# EAGLE design 4081 (EAGLE 5.06)
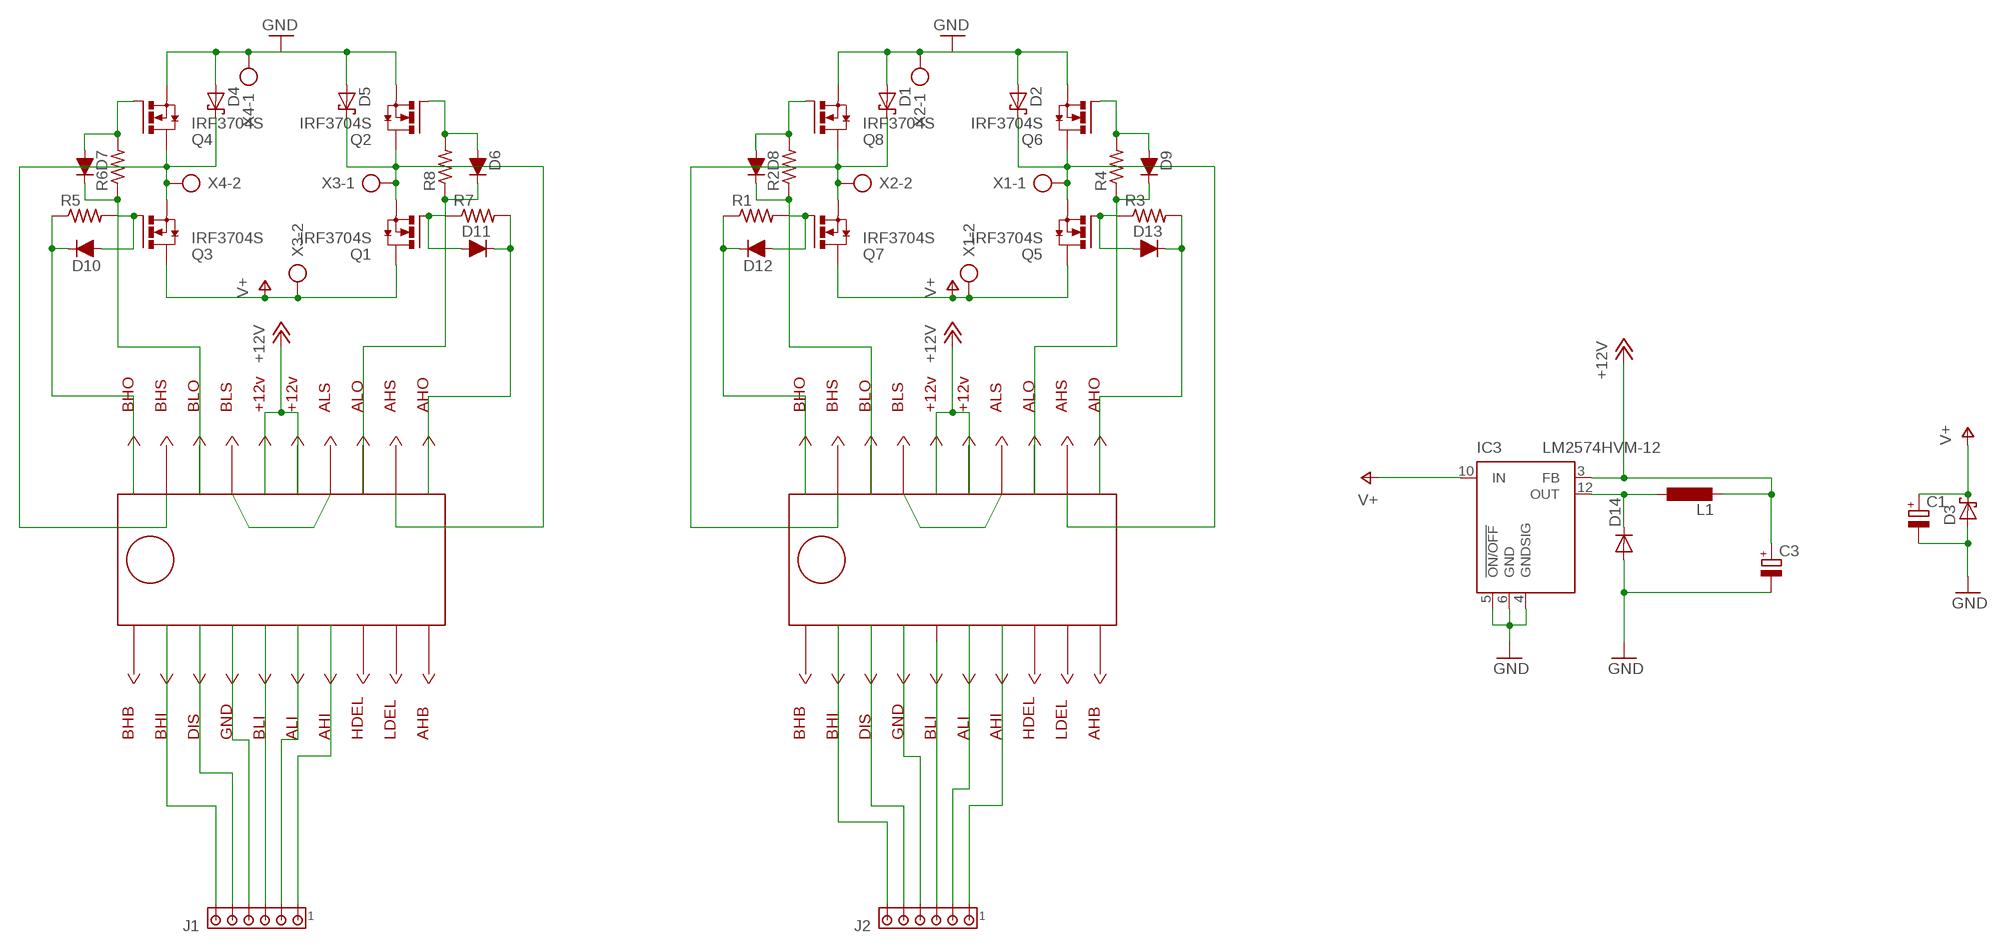
[diagram p0: schematic, sheet 1]

## Parts
C1  CPOL-EUE30-12AXIAL  [E30-12]
C3  CPOL-EU140CLH-1010  [140CLH-1010]
D1  SCHOTTKY-DIODESMC  [SMC]
D2  SCHOTTKY-DIODESMC  [SMC]
D3  SCHOTTKY-DIODESMC  [SMC]
D4  SCHOTTKY-DIODESMC  [SMC]
D5  SCHOTTKY-DIODESMC  [SMC]
D6  D-FILL-MLL-34  [MELF-MLL34]
D7  D-FILL-MLL-34  [MELF-MLL34]
D8  D-FILL-MLL-34  [MELF-MLL34]
D9  D-FILL-MLL-34  [MELF-MLL34]
D10  D-FILL-MLL-34  [MELF-MLL34]
D11  D-FILL-MLL-34  [MELF-MLL34]
D12  D-FILL-MLL-34  [MELF-MLL34]
D13  D-FILL-MLL-34  [MELF-MLL34]
D14  DIODE-DO214BA  [DO214BA]
IC1  HIP4081_SMD  [20-SOIC]
IC2  HIP4081_SMD  [20-SOIC]
IC3  LM2574HVM-12  [SO14W]
J1  MTA06-100  [10X06MTA]
J2  MTA06-100  [10X06MTA]
L1  L-EUPIS2816  [PIS2816]
Q1  IRF3704S  [D2PACK]
Q2  IRF3704S  [D2PACK]
Q3  IRF3704S  [D2PACK]
Q4  IRF3704S  [D2PACK]
Q5  IRF3704S  [D2PACK]
Q6  IRF3704S  [D2PACK]
Q7  IRF3704S  [D2PACK]
Q8  IRF3704S  [D2PACK]
R1  R-US_M1206  [M1206]
R2  R-US_M1206  [M1206]
R3  R-US_M1206  [M1206]
R4  R-US_M1206  [M1206]
R5  R-US_M1206  [M1206]
R6  R-US_M1206  [M1206]
R7  R-US_M1206  [M1206]
R8  R-US_M1206  [M1206]
X1  AK500/2  [AK500/2]
X2  AK500/2  [AK500/2]
X3  AK500/2  [AK500/2]
X4  AK500/2  [AK500/2]

## Nets
+12V: C3.+ IC1.15(VCC) IC1.16(+12V) IC2.15(VCC) IC2.16(+12V) IC3.3(FB) L1.2
AHO1: D11.1(C) IC1.11(AHO) R7.2
AHO2: D13.1(C) IC2.11(AHO) R3.2
AHS1: D5.C IC1.12(AHS) Q1.3(S) Q2.2(D) X3.1
AHS2: D2.C IC2.12(AHS) Q5.3(S) Q6.2(D) X1.1
ALO1: D6.1(C) IC1.13(ALO) R8.1
ALO2: D9.1(C) IC2.13(ALO) R4.1
ALS2: Q5.2(D) Q7.2(D) X1.2 ; supply symbol labelled V+
BHO1: D10.1(C) IC1.20(BHO) R5.1
BHO2: D12.1(C) IC2.20(BHO) R1.1
BHS1: D4.C IC1.19(BHS) Q3.3(S) Q4.2(D) X4.2
BHS2: D1.C IC2.19(BHS) Q7.3(S) Q8.2(D) X2.2
BLO1: D7.1(C) IC1.18(BLO) R6.1
BLO2: D8.1(C) IC2.18(BLO) R2.1
GND: C1.- C3.- D1.A D2.A D3.A D4.A D5.A D14.A IC1.14(ALS) IC1.17(BLS) IC2.14(ALS) IC2.17(BLS) IC3.4(GNDSIG) IC3.5(!ON/OFF) IC3.6(GND) Q2.3(S) Q4.3(S) Q6.3(S) Q8.3(S) X2.1 X4.1
N$1: D14.C IC3.12(OUT) L1.1
N$2: D8.2(A) Q8.1(G) R2.2
N$3: D9.2(A) Q6.1(G) R4.2
N$4: D13.2(A) Q5.1(G) R3.1
N$5: D12.2(A) Q7.1(G) R1.2
N$6: IC1.2(BHI) J1.1
N$7: D7.2(A) Q4.1(G) R6.2
N$8: D6.2(A) Q2.1(G) R8.2
N$9: D11.2(A) Q1.1(G) R7.1
N$10: D10.2(A) Q3.1(G) R5.2
N$11: IC1.3(DIS) J1.2
N$12: IC1.4(GND) J1.3
N$13: IC1.5(BLI) J1.4
N$14: IC1.6(ALI) J1.5
N$15: IC1.7(AHI) J1.6
N$16: IC2.2(BHI) J2.1
N$17: IC2.3(DIS) J2.2
N$18: IC2.4(GND) J2.3
N$19: J2.4
N$20: IC2.6(ALI) J2.5
N$21: IC2.7(AHI) J2.6
V+: C1.+ D3.C IC3.10(IN) Q1.2(D) Q3.2(D) X3.2
Unconnected: IC1.1(BHB) IC1.8(HDEL) IC1.9(LDEL) IC1.10(AHB) IC2.1(BHB) IC2.5(BLI) IC2.8(HDEL) IC2.9(LDEL) IC2.10(AHB)

## Library data of the parts
C1 C3 = rcl:CPOL-EU: POLARIZED CAPACITOR, European symbol
D1-D5 = diode:SCHOTTKY-DIODE: Schottky Diode
D6-D13 = semicon-smd-ipc:D-FILL-: DIODE filled
D14 = diode:DIODE-: DIODE
IC1 IC2 = A-JD3:HIP4081_SMD
IC3 = linear:LM2574?-*: SIMPLE SWITCHER 0.5A Step-Down Voltage Regulator Source: http://cache.national.com/ds/LM/LM2574.pdf
J1 J2 = con-amp:MTA06-100: AMP connector
L1 = rcl:L-EU: INDUCTOR, European symbol
Q1-Q8 = transistor-power:IRF3704: SMPS MOSFET HEXFET® Power MOSFET Source: http://www.irf.com/product-info/datasheets/data/irf3704.pdf
R1-R8 = rcl:R-US_: RESISTOR, American symbol
X1-X4 = con-ptr500:AK500/2: CONNECTOR

## Board
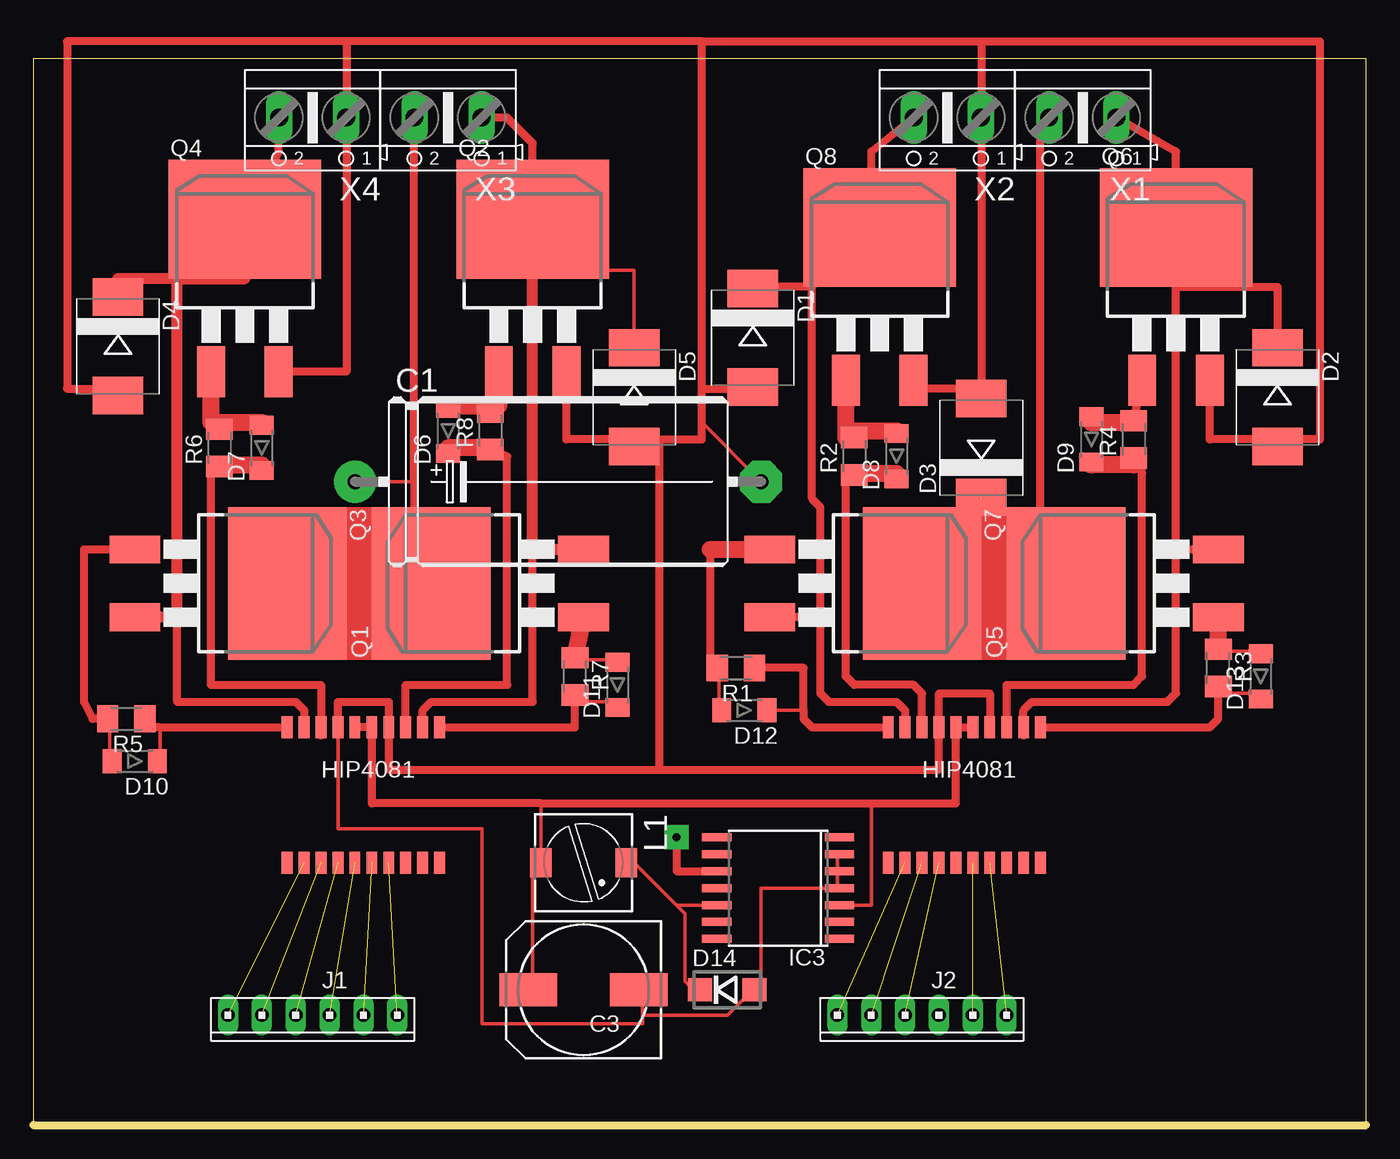
[diagram p1: board, top side]
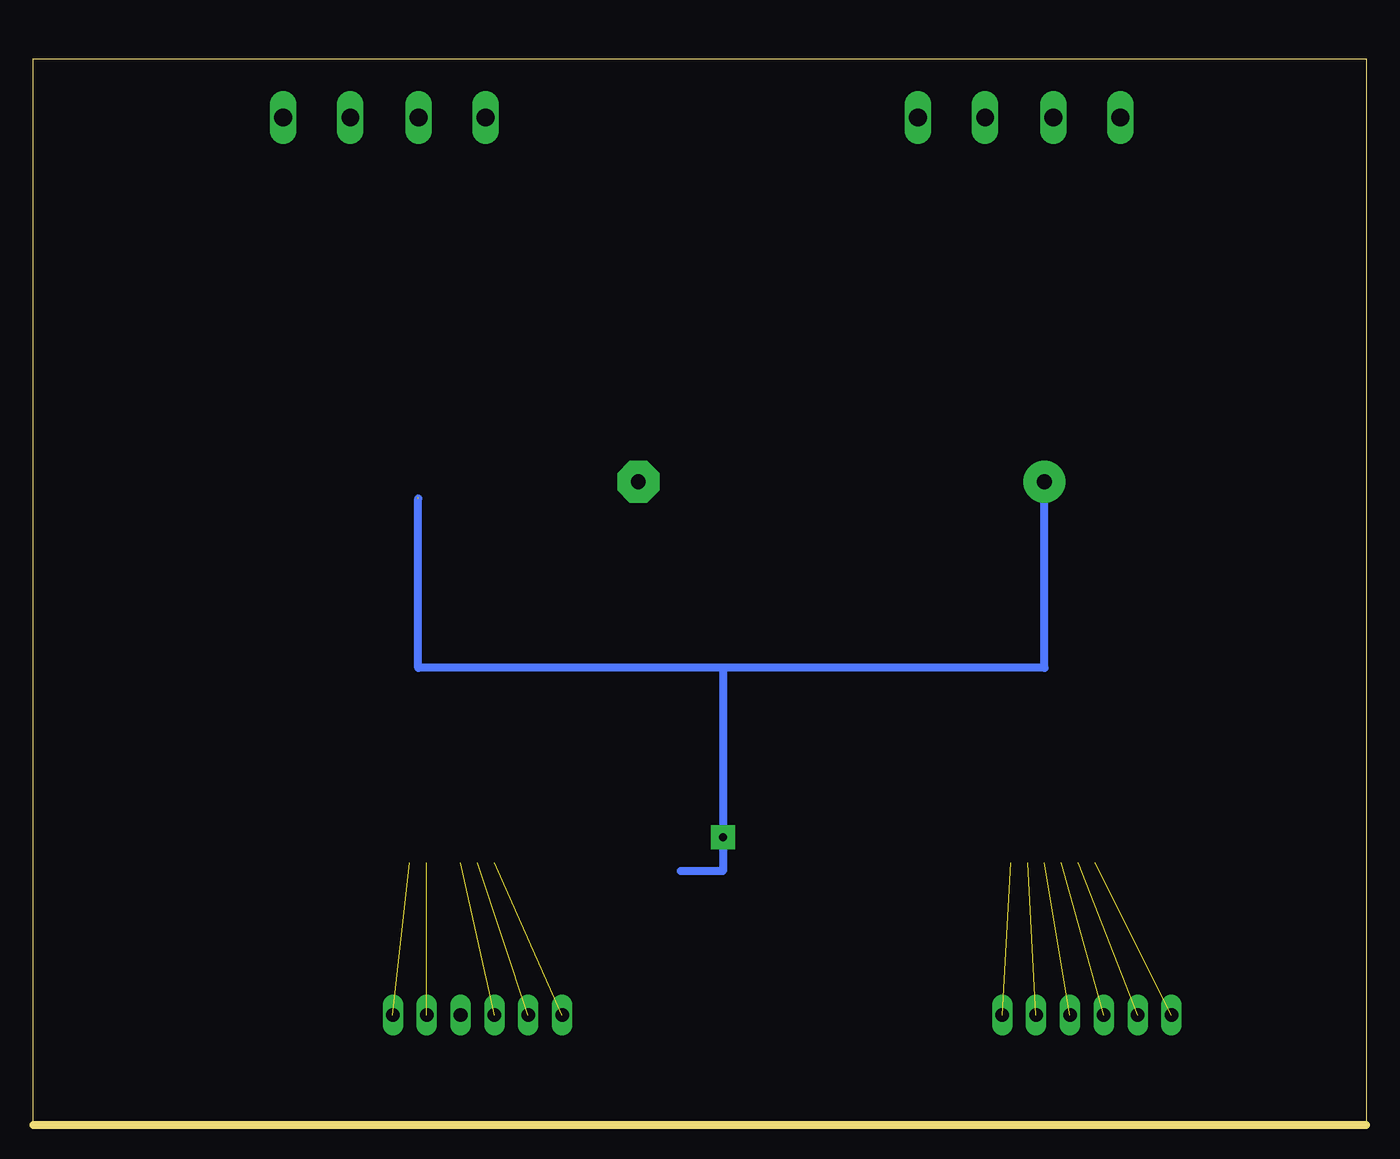
[diagram p2: board, bottom side, seen from below]

Size 100 x 80 mm. Coordinates in mm from the lower left corner, seen from the top.
Outline: 0,0 100,0 100,80 0,80 0,0
Copper layers (1*16): Top 0.035mm / dielectric 1.5mm / Bottom 0.035mm
Design rules "default *": minimum track width 10mil, minimum drill 24mil, track to track 25mil, track to pad 25mil, pad to pad 8mil, via to via 8mil, smd to smd 8mil, copper to edge 40mil, drill to drill 8mil, minimum pad ring 10mil, minimum via ring 8mil, stop-mask expansion 4mil, vias tented up to drill 0mil, thermal gap 10mil

### Footprints (pad centres in the part's own frame; a part is rotated, then mirrored left to right if it is on the bottom)
E30-12 = drill 1.118 pad 3.15 round: + -15.24,0 | drill 1.118 pad 3.15 octagon: - 15.24,0
140CLH-1010 = smd 4.3 x 2.5: + 4.15,0; - -4.15,0
SMC = smd 2.8 x 3.8: A 3.7,0; C -3.7,0
MELF-MLL34 = smd 1.4 x 1.8: 1 -1.7,0; 2 1.7,0
DO214BA = smd 1.8 x 1.7: A 2.05,0; C -2.05,0
20-SOIC = smd 0.813 x 1.676: 1 -5.08,-5.08; 2 -3.81,-5.08; 3 -2.54,-5.08; 4 -1.27,-5.08; 5 0,-5.08; 6 1.27,-5.08; 7 2.54,-5.08; 8 3.81,-5.08; 9 5.08,-5.08; 10 6.35,-5.08; 11 6.35,5.08; 12 5.08,5.08; 13 3.81,5.08; 14 2.54,5.08; 15 1.27,5.08; 16 0,5.08; 17 -1.27,5.08; 18 -2.54,5.08; 19 -3.81,5.08; 20 -5.08,5.08
SO14W = smd 0.6 x 2.2: 1 -3.81,-4.6; 2 -2.54,-4.6; 3 -1.27,-4.6; 4 0,-4.6; 5 1.27,-4.6; 6 2.54,-4.6; 7 3.81,-4.6; 8 3.81,4.6; 9 2.54,4.6; 10 1.27,4.6; 11 0,4.6; 12 -1.27,4.6; 13 -2.54,4.6; 14 -3.81,4.6
10X06MTA = drill 1.016 long: 1 6.35,0; 2 3.81,0; 3 1.27,0; 4 -1.27,0; 5 -3.81,0; 6 -6.35,0
PIS2816 = smd 2.2 x 1.6: 1 0,3.2; 2 0,-3.2
D2PACK = smd 2.083 x 3.81: 1 -2.54,-8.89; 3 2.54,-8.89 | smd 11.43 x 8.89: 2 0,2.54
M1206 = smd 1.6 x 2: 1 -1.4,0; 2 1.4,0
AK500/2 = drill 1.321 long: 1 -2.515,0; 2 2.515,0

### Placement (x,y rotation side)
C1  39.37,48.26 0 top
C3  41.27,10.16 180 top
D1  53.98,59.05 270 top
D2  93.34,54.61 270 top
D3  71.12,50.8 90 top
D4  6.35,58.42 270 top
D5  45.09,54.61 270 top
D6  31.11,52.07 90 top
D7  17.14,50.8 90 top
D8  64.77,50.16 90 top
D9  79.38,51.44 90 top
D10  7.62,27.3 180 top
D11  43.81,33.02 90 top
D12  53.34,31.11 180 top
D13  92.08,33.66 90 top
D14  52.07,10.16 0 top
IC1  24.13,24.77 0 top
IC2  69.22,24.77 0 top
IC3  55.88,17.78 90 top
J1  20.95,8.26 180 top
J2  66.67,8.26 180 top
L1  41.27,19.68 270 top
Q1  32.38,40.64 90 top
Q2  37.47,65.41 0 top
Q3  16.51,40.64 270 top
Q4  15.88,65.41 0 top
Q5  80.01,40.64 90 top
Q6  85.72,64.77 0 top
Q7  64.14,40.64 270 top
Q8  63.5,64.77 0 top
R1  52.7,34.29 180 top
R2  61.59,50.16 90 top
R3  88.9,34.29 270 top
R4  82.55,51.44 90 top
R5  6.99,30.48 180 top
R6  13.97,50.8 90 top
R7  40.64,33.66 270 top
R8  34.29,52.07 90 top
X1  78.74,75.56 180 top
X2  68.58,75.56 180 top
X3  31.11,75.56 180 top
X4  20.95,75.56 180 top

### Tracks (layer width: path | path; a pad name or v marks a point on that pad's centre or on a via)
+12V
  Top 0.254: 38.1,24.13 38.1,19.68 L1.2 37.47,19.68 37.47,10.16 C3.+ | 62.87,24.13 62.87,16.51 IC3.3
  Top 0.61: IC2.15 IC2.16 69.22,24.13 62.87,24.13 38.1,24.13 25.4,24.13 IC1.15 IC1.16
AHO1
  Top 0.254: 40.64,31.75 43.81,31.75 D11.1
  Top 0.61: IC1.11 40.64,29.84 40.64,31.75 R7.2
AHO2
  Top 0.254: 88.9,32.38 92.08,32.38 D13.1
  Top 0.61: IC2.11 88.27,29.84 88.9,30.48 88.9,32.38 R3.2
AHS1
  Top 0.254: Q2.2 37.47,64.14 45.09,64.14 D5.C
  Top 0.61: Q2.2 37.47,73.66 35.56,75.56 X3.1 | IC1.12 29.21,31.11 29.84,31.75 37.47,31.75 37.47,43.18
  Top 0.813: Q1.3 37.47,43.18 37.47,64.14
AHS2
  Top 0.61: 74.3,29.21 IC2.12 74.3,31.11 74.93,31.75 85.09,31.75 85.72,32.38 85.72,43.18 | 85.72,43.18 Q5.3 | 85.72,43.18 85.72,62.87 | 85.72,62.87 Q6.2 85.72,73.03 81.28,75.56 X1.1 | 85.72,62.87 93.34,62.87 D2.C
ALO1
  Top 0.254: 31.11,50.8 D6.1 | R8.1 34.29,50.8
  Top 0.61: IC1.13 27.94,33.02 35.56,33.02 35.56,50.16 R8.1
  Top 1.27: 34.29,50.8 31.11,50.8
ALO2
  Top 0.254: 79.38,49.53 D9.1 | R4.1 82.55,49.53
  Top 0.61: IC2.13 73.03,33.02 82.55,33.02 83.19,33.66 83.19,49.53 82.68,50.03 R4.1 83.19,48.9
  Top 1.27: 82.55,49.53 79.38,49.53
ALS2
  Top 0.61: Q7.2 Q5.2 77.47,45.09 75.56,45.72 75.56,74.93 76.2,75.56 X1.2
BHO1
  Top 0.254: 9.53,29.84 9.53,27.3 D10.1
  Top 0.61: IC1.20 9.53,29.84 8.89,29.84 8.38,30.35 R5.1
BHO2
  Top 0.254: D12.1 57.78,31.11
  Top 0.61: IC2.20 58.42,29.84 57.78,30.48 57.78,31.11 57.78,34.29 R1.1
BHS1
  Top 0.254: 15.88,63.5 Q4.2
  Top 0.61: Q4.2 18.41,73.03 18.41,75.56 X4.2 | IC1.19 20.32,31.11 19.68,31.75 10.79,31.75 10.79,38.1
  Top 0.813: 10.79,63.5 15.88,63.5 | 10.79,63.5 6.35,63.5 D4.C | Q3.3 10.79,38.1 10.79,63.5
BHS2
  Top 0.61: IC2.19 65.41,31.11 64.77,31.75 59.69,31.75 59.05,32.38 59.05,38.1 | 59.05,38.1 Q7.3 | 58.42,62.87 62.87,67.94 | 59.05,38.1 59.05,46.35 58.42,46.99 58.42,62.87 | 58.42,62.87 53.98,62.87 D1.C | 62.87,67.94 62.87,73.03 66.04,75.56 X2.2 | 62.87,67.94 Q8.2
BLO1
  Top 0.254: 17.14,49.53 D7.1 | R6.1 13.97,49.53
  Top 0.61: 21.59,29.21 IC1.18 21.59,33.02 13.34,33.02 13.34,48.9 13.97,48.9 R6.1
  Top 1.27: 13.97,49.53 17.14,49.53
BLO2
  Top 0.254: 64.77,48.9 D8.1 | R2.1 61.59,48.9
  Top 0.61: IC2.18 66.67,32.38 66.04,33.02 61.59,33.02 60.96,33.66 60.96,48.26 61.47,48.77 R2.1
  Top 1.27: 61.59,48.9 64.77,48.9
GND
  Top 0.254: 50.16,52.7 C1.- | 60.33,17.78 60.33,19.05 | 60.33,19.05 60.33,20.32 IC3.6 | 60.33,19.05 IC3.5 | 45.72,8.26 52.07,8.26 53.98,10.16 D14.A 54.61,10.16 54.61,17.78 60.33,17.78 | 45.72,8.26 45.72,10.16 C3.- | 60.33,17.78 IC3.4 | 45.72,8.26 45.72,7.62 33.66,7.62 33.66,22.23 22.86,22.23 IC1.17
  Top 0.61: 71.12,75.56 71.12,55.24 | 46.99,51.44 40.01,51.44 Q2.3 | 50.16,55.24 50.16,52.7 50.16,51.44 46.99,51.44 | 50.16,55.24 53.98,55.24 D1.A | 46.99,51.44 44.45,51.44 D5.A 46.99,51.44 | 50.16,81.28 71.12,81.28 | 50.16,55.24 50.16,81.28 | 93.34,51.44 88.27,51.44 Q6.3 | 71.12,55.24 66.04,55.24 Q8.3 | 71.12,55.24 D3.A | 23.5,81.28 2.54,81.28 2.54,55.24 6.35,55.24 D4.A | 23.5,81.28 23.5,75.56 | Q4.3 23.5,56.52 23.5,75.56 | 23.5,75.56 X4.1 | 50.16,81.28 23.5,81.28 | 93.34,51.44 96.52,51.44 96.52,81.28 71.12,81.28 | 71.12,81.28 71.12,75.56 | 93.34,51.44 D2.A | 71.12,75.56 X2.1 | IC2.14 71.75,32.38 67.94,32.38 IC2.17 67.94,26.67 46.99,26.67 | IC1.17 22.86,31.75 26.67,31.75 IC1.14 26.67,26.67 46.99,26.67 | 46.99,26.67 46.99,51.44
N$1
  Top 0.254: 48.26,16.51 45.09,19.68 L1.1 | 48.26,16.51 48.9,15.88 48.9,10.79 49.53,10.16 D14.C | 48.26,16.51 IC3.12
N$2
  Top 0.254: 64.77,52.07 D8.2 | R2.2 61.59,52.07
  Top 1.27: R2.2 60.96,51.56 Q8.1 | 61.59,52.07 64.77,52.07
N$3
  Top 0.254: D9.2 79.38,52.7 | 82.55,52.7 R4.2
  Top 0.61: R4.2 Q6.1
  Top 1.27: 79.38,52.7 82.55,52.7
N$4
  Top 0.254: D13.2 92.08,35.56 88.9,35.56 R3.1
  Top 1.27: R3.1 Q5.1
N$5
  Top 0.254: D12.2 51.44,31.11 51.44,34.29 R1.2
  Top 0.61: R1.2 51.3,34.42 50.8,34.92 50.8,43.18
  Top 1.27: 50.8,43.18 Q7.1
N$6  (1 unrouted)
N$7
  Top 0.254: 17.14,52.7 D7.2 | R6.2 13.97,52.7
  Top 0.61: R6.2 13.97,52.07
  Top 1.27: 13.97,52.07 13.34,52.7 Q4.1 | 13.97,52.7 17.14,52.7
N$8
  Top 0.61: 34.92,55.24 Q2.1 | R8.2 34.92,53.98 34.92,54.61
  Top 1.27: 34.92,54.61 34.92,55.24 | 34.92,53.98 31.11,53.98 D6.2
N$9
  Top 0.254: D11.2 43.81,34.92 40.64,34.92 R7.1
  Top 1.27: R7.1 Q1.1
N$10
  Top 0.254: D10.2 5.71,27.3 5.71,30.48 R5.2
  Top 0.61: Q3.1 3.81,43.18 3.81,31.75 4.45,30.48 R5.2
N$11  (1 unrouted)
N$12  (1 unrouted)
N$13  (1 unrouted)
N$14  (1 unrouted)
N$15  (1 unrouted)
N$16  (1 unrouted)
N$17  (1 unrouted)
N$18  (1 unrouted)
N$20  (1 unrouted)
N$21  (1 unrouted)
V+  (via drill 0.6 pad 1.78)  (1 unrouted)
  Top 0.254: C1.+ 28.57,48.26
  Top 0.61: Q3.2 Q1.2 29.84,43.81 28.57,45.72 28.57,48.26 28.57,75.56 X3.2 | 51.44,19.05 IC3.10 48.26,19.05 v48.26,21.59
  Bottom 0.61: C1.+ 24.13,34.29 48.26,34.29 | 48.26,34.29 v48.26,21.59 48.26,19.05 51.44,19.05 | 48.26,34.29 71.12,34.29 71.12,46.99
(copper drawn outside any net)
  shapes: Top area x2